# EAGLE design tt-i2c-jr (EAGLE 9.2.2)
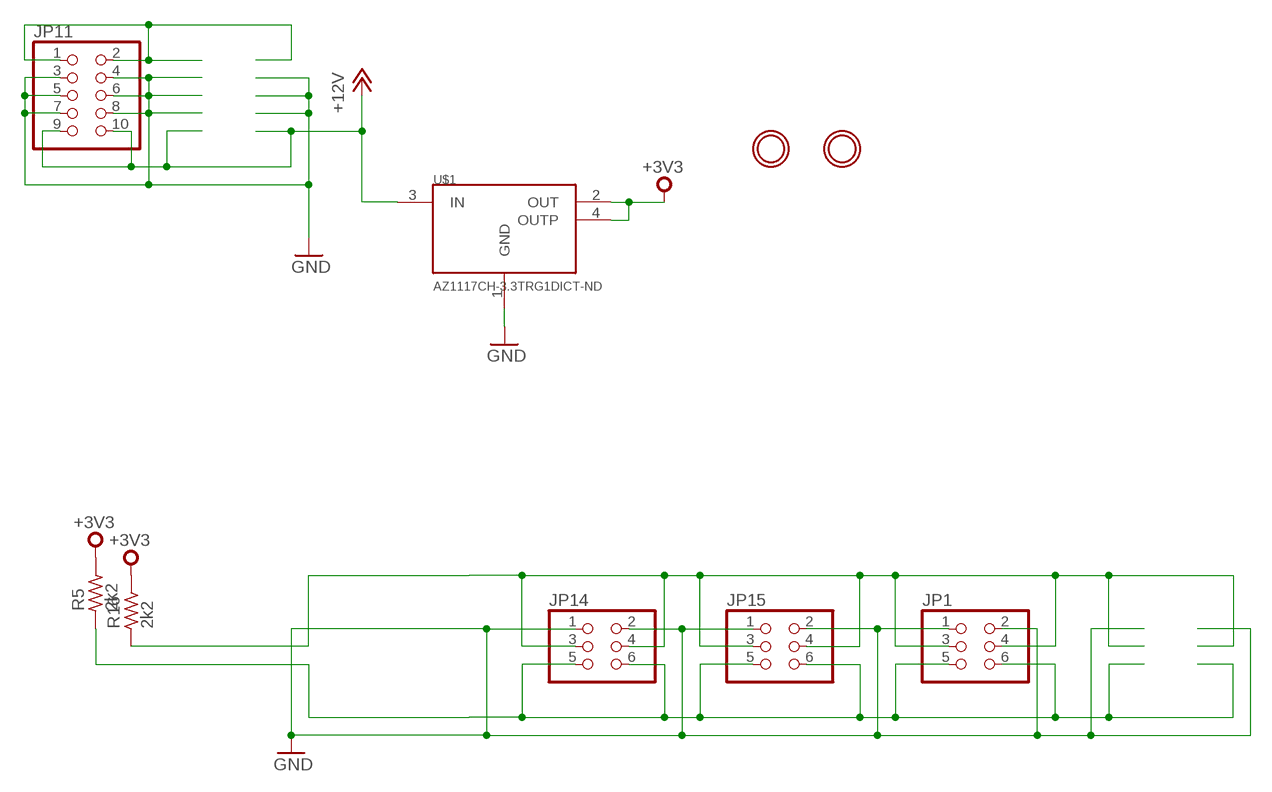
[diagram p0: schematic, sheet 1]

## Parts
JP1  PINHD-2X3  [2X03]
JP11  PINHD-2X5  [2X05]
JP14  PINHD-2X3  [2X03]
JP15  PINHD-2X3  [2X03]
R5  2k2  R_1206  [R1206]
R16  2k2  R_1206  [R1206]
U$1  AZ1117CH-3.3TRG1DICT-ND  ADP3339  [SOT223]
U$2  MOUNTINGHOLE3.0THIN  [MOUNTINGHOLE_3.0_PLATEDTHIN]
U$3  MOUNTINGHOLE3.0THIN  [MOUNTINGHOLE_3.0_PLATEDTHIN]

## Nets
+3V3: R5.2 R16.2 U$1.2(OUT) U$1.4(OUTP)
+12V: JP11.9 JP11.10 U$1.3(IN)
GND: JP1.1 JP1.2 JP11.3 JP11.4 JP11.5 JP11.6 JP11.7 JP11.8 JP14.1 JP14.2 JP15.1 JP15.2 U$1.1(GND)
N$6: JP11.1 JP11.2
SCL: JP1.3 JP1.4 JP14.3 JP14.4 JP15.3 JP15.4 R16.1
SDA: JP1.5 JP1.6 JP14.5 JP14.6 JP15.5 JP15.6 R5.1

## Library data of the parts
JP1 JP14 JP15 = pinhead:PINHD-2X3: PIN HEADER
JP11 = pinhead:PINHD-2X5: PIN HEADER
R5 R16 = rc-master-smd:R_: RESISTOR
U$1 = monome-inc:ADP3339
U$2 U$3 = microbuilder:MOUNTINGHOLE: Mounting Hole For #2 screws (0.086"/2.18mm width, 0.094"/2.4mm hole) use 2.5mm

## Board
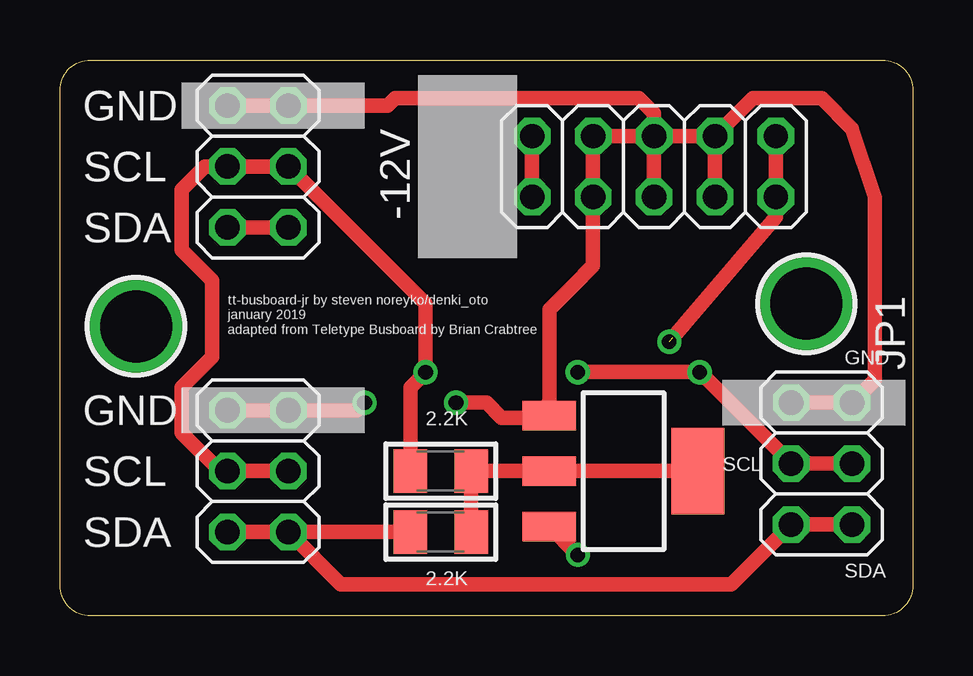
[diagram p1: board, top side]
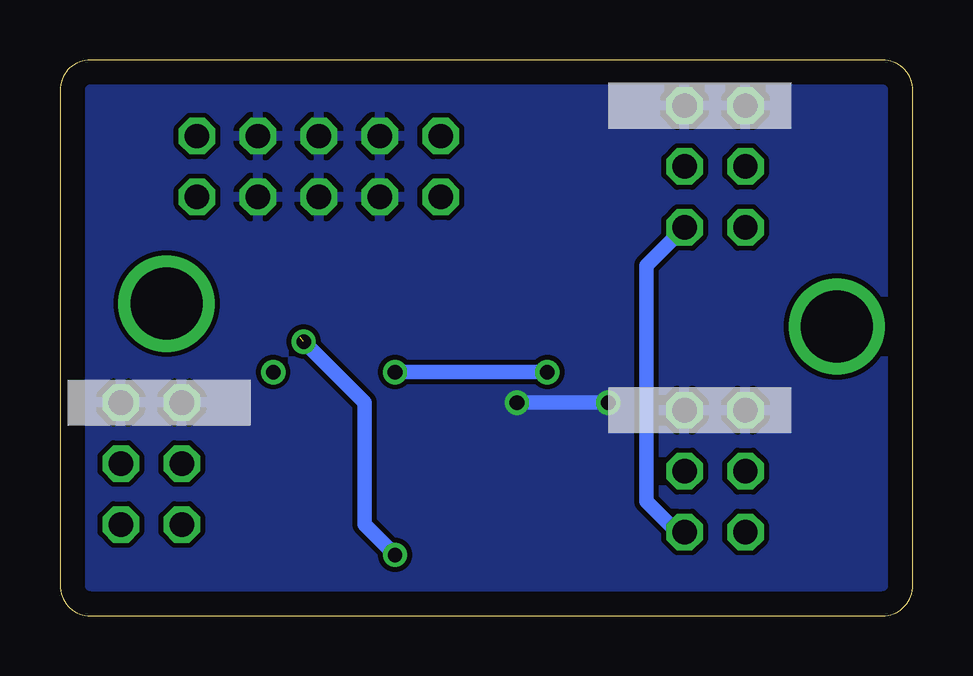
[diagram p2: board, bottom side, seen from below]

Size 35.56 x 23.18 mm. Coordinates in mm from the lower left corner, seen from the top.
Outline: 0,6.35 0,21.91 arc-90 1.27,23.18 34.29,23.18 arc-90 35.56,21.91 35.56,1.27 arc-90 34.29,0 1.27,0 arc-90 0,1.27 0,6.35
Copper layers (1*16): Top 0.035mm / dielectric 1.5mm / Bottom 0.035mm
Design rules "default": minimum track width 10mil, minimum drill 24mil, track to track 8mil, track to pad 8mil, pad to pad 8mil, via to via 8mil, smd to smd 8mil, copper to edge 40mil, drill to drill 8mil, minimum pad ring 10mil, minimum via ring 8mil, stop-mask expansion 4mil, vias tented up to drill 0mil, thermal gap 10mil

### Footprints (pad centres in the part's own frame; a part is rotated, then mirrored left to right if it is on the bottom)
2X03 = drill 1.016 octagon: 1 -2.54,-1.27; 2 -2.54,1.27; 3 0,-1.27; 4 0,1.27; 5 2.54,-1.27; 6 2.54,1.27
2X05 = drill 1.016 octagon: 1 -5.08,-1.27; 2 -5.08,1.27; 3 -2.54,-1.27; 4 -2.54,1.27; 5 0,-1.27; 6 0,1.27; 7 2.54,-1.27; 8 2.54,1.27; 9 5.08,-1.27; 10 5.08,1.27
R1206 = smd 1.4 x 1.8: 1 -1.27,0; 2 1.27,0
SOT223 = smd 1.219 x 2.235: 1 -2.311,-3.099; 2 0,-3.099; 3 2.311,-3.099 | smd 3.6 x 2.2: 4 0,3.099
MOUNTINGHOLE_3.0_PLATEDTHIN = drill 3 pad 3.6: P$1 0,0

### Placement (x,y rotation side)
JP1  31.75,6.35 270 top
JP11  24.77,18.73 0 top
JP14  8.26,18.73 270 top
JP15  8.26,6.03 270 top
R5  15.88,3.49 0 top
R16  15.88,6.03 0 top
U$1  23.49,6.03 270 top
U$2  3.18,12.06 0 top
U$3  31.12,13.02 0 top

### Tracks (layer width: path | path; a pad name or v marks a point on that pad's centre or on a via)
+3V3
  Top 0.61: U$1.4 U$1.2 R16.2 R5.2
+12V  (via drill 0.6)  (1 unrouted)
  Top 0.406: U$1.3 20.73,3.72
  Top 0.61: JP11.10 JP11.9 29.85,16.62 25.55,11.6 | v21.59,2.54 21.58,2.54 U$1.3
  Bottom 0.61: v25.4,11.43 22.86,8.89 22.86,3.81 v21.59,2.54
GND  (via drill 0.61)
  Top 0.61: JP11.8 JP11.7 | JP11.6 JP11.4 JP11.3 22.23,14.61 21.35,13.73 20.4,12.78 20.4,11.51 20.4,8.89 | JP11.6 JP11.8 | JP11.6 JP11.5 | JP14.1 JP14.2 13.65,21.27 13.97,21.59 24.13,21.59 24.77,20.95 JP11.6 | JP11.8 28.89,21.59 31.75,21.59 33.02,20.32 33.97,17.46 33.97,11.75 33.97,9.84 JP1.2 JP1.1 | JP15.1 JP15.2 12.38,8.57 v12.7,8.89 | 20.4,8.89 U$1.1 | v16.51,8.89 17.78,8.89 18.41,8.26 19.76,8.26 20.4,8.89
  Bottom 0.61: v12.7,8.89 v16.51,8.89
  pour Bottom: 0.32,0.32 0.32,22.86 34.93,22.86 34.93,0.32
N$6
  Top 0.61: JP11.2 JP11.1
SCL  (via drill 0.61)
  Top 0.61: JP15.4 JP15.3 6.67,6.03 5.08,7.62 5.08,9.53 6.35,10.79 6.35,13.97 5.08,15.24 5.08,17.78 6.03,18.73 JP14.3 JP14.4 15.24,13.02 | 15.24,12.7 15.24,13.02 | JP1.4 JP1.3 v26.67,10.16 v21.59,10.16 | R16.1 14.61,9.53 v15.24,10.16 15.24,13.02
  Bottom 0.61: v21.59,10.16 v15.24,10.16
SDA
  Top 0.61: JP15.5 JP15.6 | JP14.6 JP14.5 | JP15.6 R5.1 | JP15.6 11.7,1.32 27.99,1.32 JP1.5 JP1.6
  Bottom 0.61: JP15.6 9.84,3.49 11.11,4.76 11.11,14.61 JP14.6

### Text on the board
tPlace: GND | SCL | -12V | SDA | tt-busboard-jr by steven noreyko/denki_oto / january 2019 / adapted from Teletype Busboard by Brian Crabtree | GND | GND | SCL | SCL | SDA | SDA
tNames: 2.2K | 2.2K